# EAGLE design RGB LED 1.2 (EAGLE 5.04)
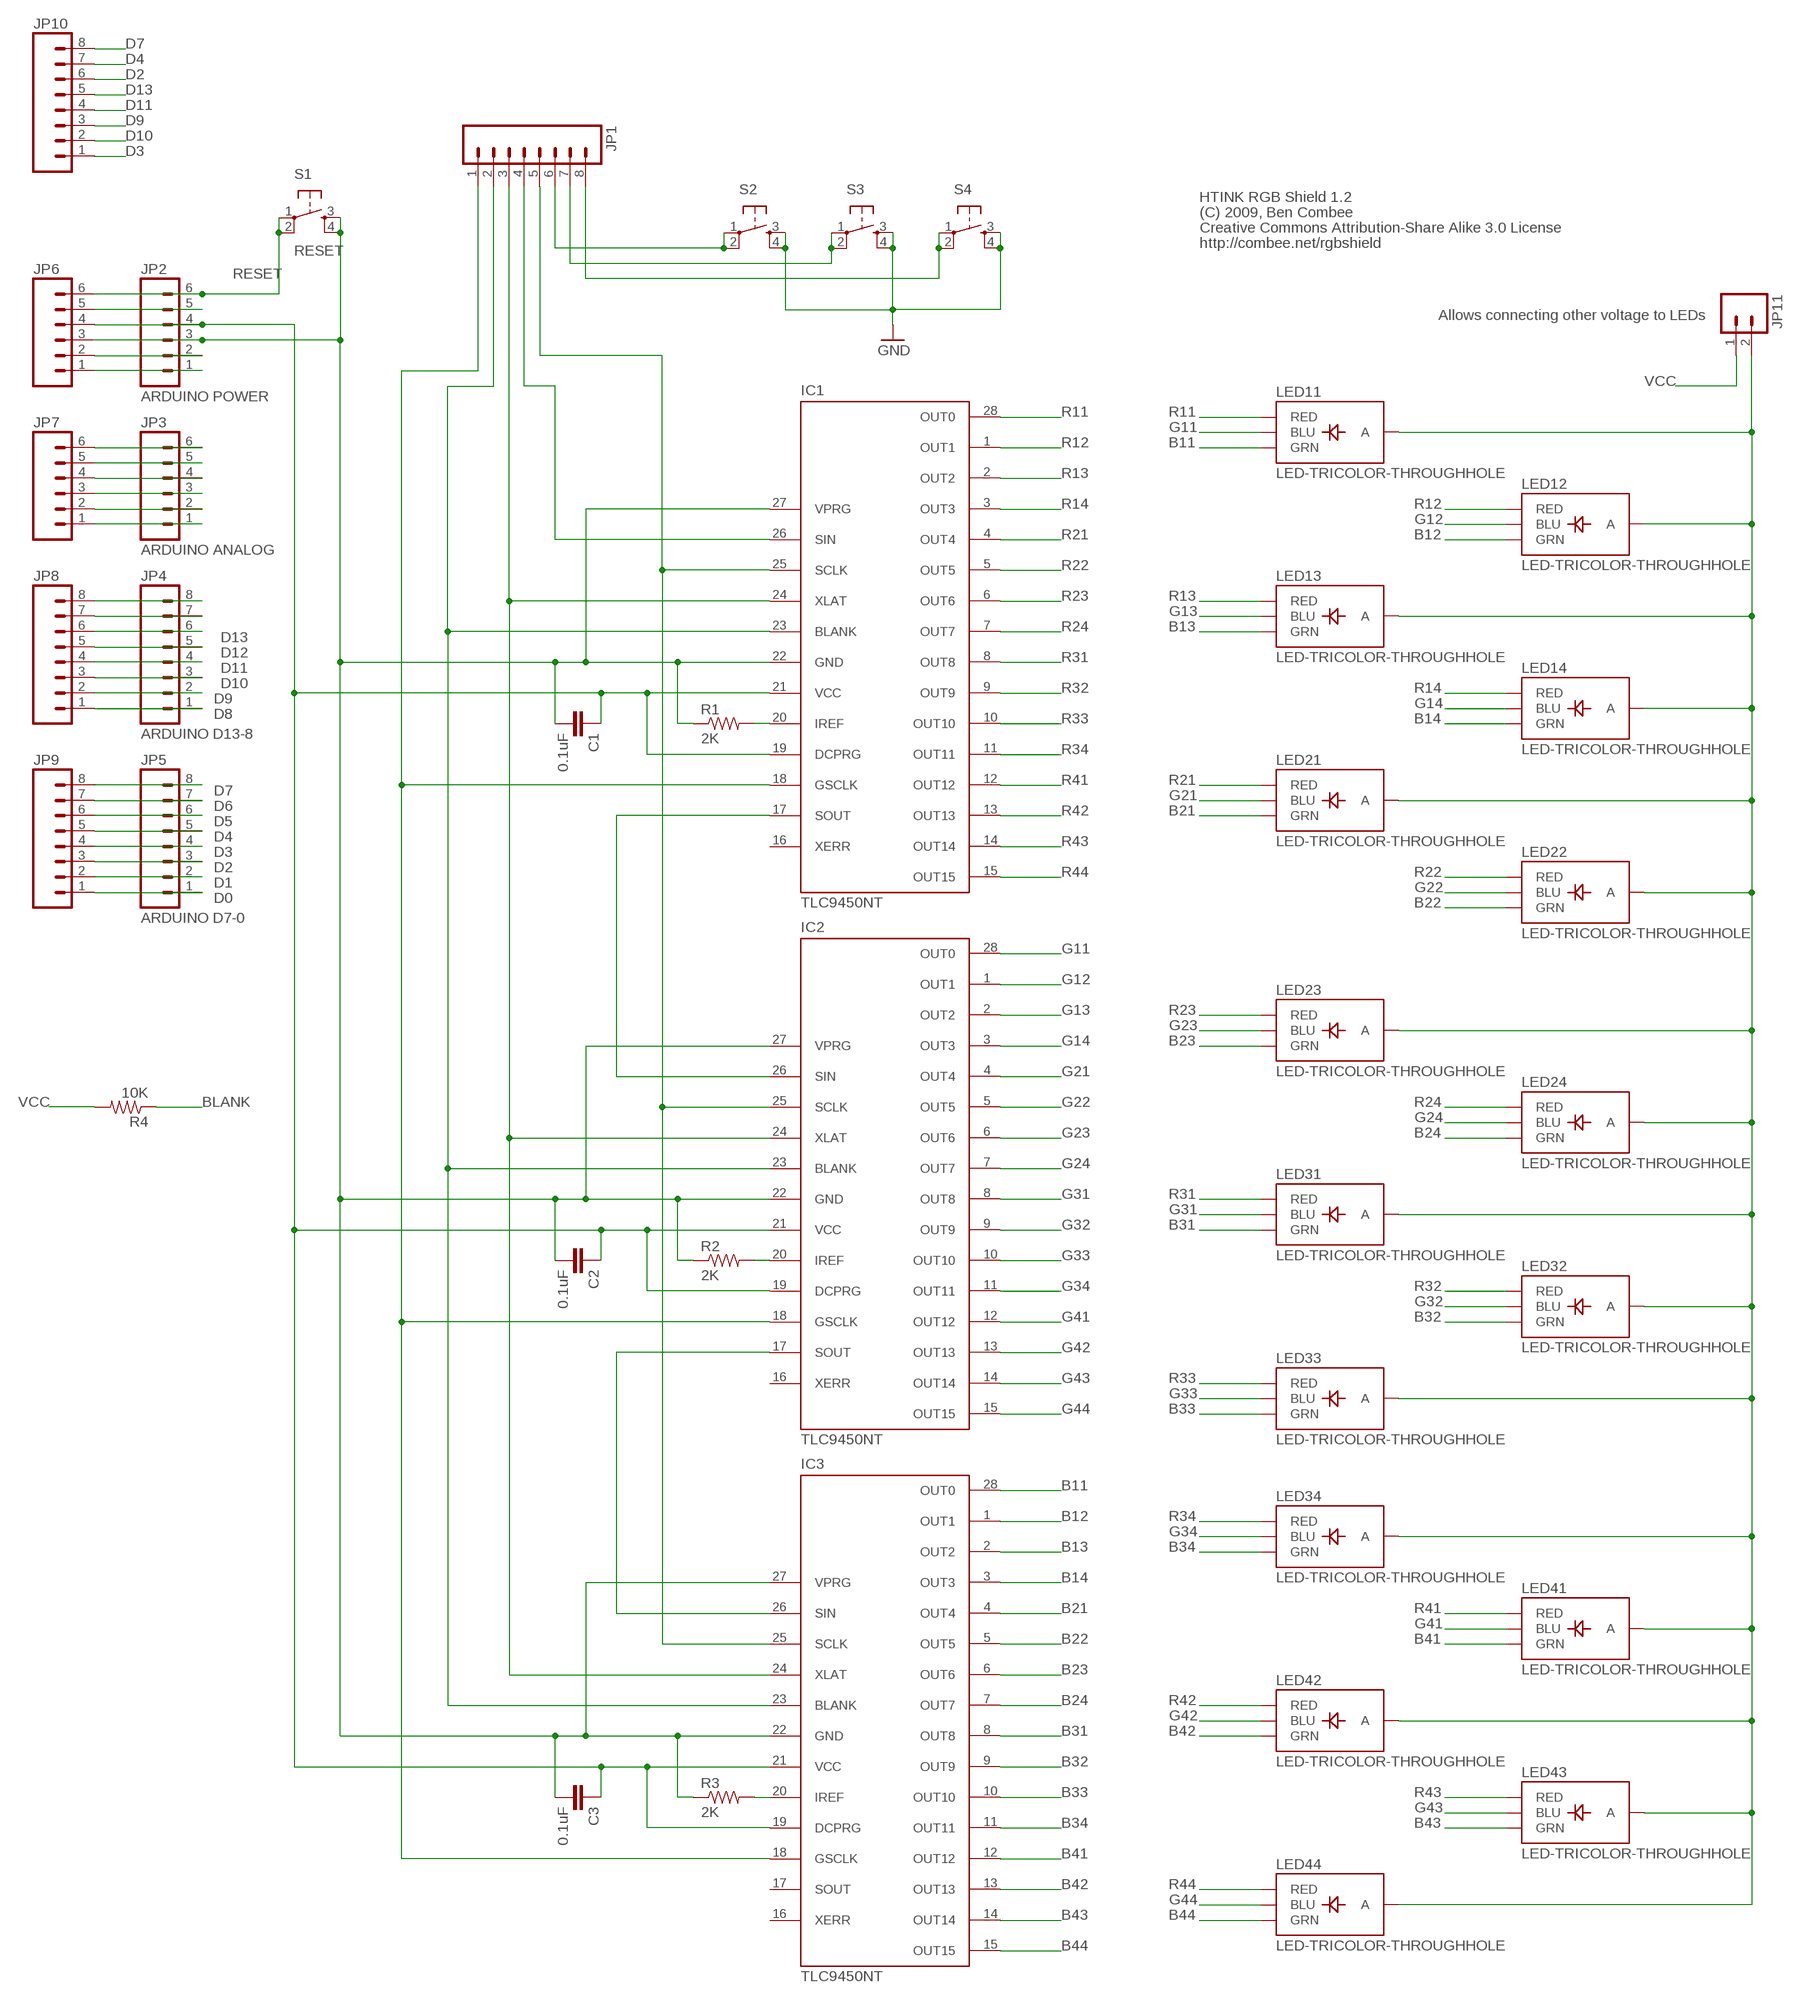
[diagram p0: schematic, sheet 1]

## Parts
C1  0.1uF  CAPPTH  [CAP-PTH-SMALL]
C2  0.1uF  CAPPTH  [CAP-PTH-SMALL]
C3  0.1uF  CAPPTH  [CAP-PTH-SMALL]
IC1  TLC9450NT  [DIL28-3]
IC2  TLC9450NT  [DIL28-3]
IC3  TLC9450NT  [DIL28-3]
JP1  M08LOCK  [1X08_LOCK]
JP2  ARDUINO POWER  M06LOCK  [1X06_LOCK]
JP3  ARDUINO ANALOG  M06LOCK  [1X06_LOCK]
JP4  ARDUINO D13-8  M08LOCK  [1X08_LOCK]
JP5  ARDUINO D7-0  M08LOCK  [1X08_LOCK]
JP6  M06LOCK  [1X06_LOCK]
JP7  M06LOCK  [1X06_LOCK]
JP8  M08LOCK  [1X08_LOCK]
JP9  M08LOCK  [1X08_LOCK]
JP10  M08LOCK  [1X08_LOCK]
JP11  M02LOCK  [1X02_LOCK]
LED11  LED-TRICOLOR-THROUGHHOLE  [LED-TRICOLOR-THROUGHHOLE]
LED12  LED-TRICOLOR-THROUGHHOLE  [LED-TRICOLOR-THROUGHHOLE]
LED13  LED-TRICOLOR-THROUGHHOLE  [LED-TRICOLOR-THROUGHHOLE]
LED14  LED-TRICOLOR-THROUGHHOLE  [LED-TRICOLOR-THROUGHHOLE]
LED21  LED-TRICOLOR-THROUGHHOLE  [LED-TRICOLOR-THROUGHHOLE]
LED22  LED-TRICOLOR-THROUGHHOLE  [LED-TRICOLOR-THROUGHHOLE]
LED23  LED-TRICOLOR-THROUGHHOLE  [LED-TRICOLOR-THROUGHHOLE]
LED24  LED-TRICOLOR-THROUGHHOLE  [LED-TRICOLOR-THROUGHHOLE]
LED31  LED-TRICOLOR-THROUGHHOLE  [LED-TRICOLOR-THROUGHHOLE]
LED32  LED-TRICOLOR-THROUGHHOLE  [LED-TRICOLOR-THROUGHHOLE]
LED33  LED-TRICOLOR-THROUGHHOLE  [LED-TRICOLOR-THROUGHHOLE]
LED34  LED-TRICOLOR-THROUGHHOLE  [LED-TRICOLOR-THROUGHHOLE]
LED41  LED-TRICOLOR-THROUGHHOLE  [LED-TRICOLOR-THROUGHHOLE]
LED42  LED-TRICOLOR-THROUGHHOLE  [LED-TRICOLOR-THROUGHHOLE]
LED43  LED-TRICOLOR-THROUGHHOLE  [LED-TRICOLOR-THROUGHHOLE]
LED44  LED-TRICOLOR-THROUGHHOLE  [LED-TRICOLOR-THROUGHHOLE]
R1  2K  R-US_0309/12  [0309/12]
R2  2K  R-US_0309/12  [0309/12]
R3  2K  R-US_0309/12  [0309/12]
R4  10K  R-US_0309/12  [0309/12]
S1  RESET  TAC_SWITCHPTH  [TACTILE-PTH]
S2  TAC_SWITCHPTH  [TACTILE-PTH]
S3  TAC_SWITCHPTH  [TACTILE-PTH]
S4  TAC_SWITCHPTH  [TACTILE-PTH]

## Nets
B11: IC3.28(OUT0) LED11.GRN
B12: IC3.1(OUT1) LED12.GRN
B13: IC3.2(OUT2) LED13.GRN
B14: IC3.3(OUT3) LED14.GRN
B21: IC3.4(OUT4) LED21.GRN
B22: IC3.5(OUT5) LED22.GRN
B23: IC3.6(OUT6) LED23.GRN
B24: IC3.7(OUT7) LED24.GRN
B31: IC3.8(OUT8) LED31.GRN
B32: IC3.9(OUT9) LED32.GRN
B33: IC3.10(OUT10) LED33.GRN
B34: IC3.11(OUT11) LED34.GRN
B41: IC3.12(OUT12) LED41.GRN
B42: IC3.13(OUT13) LED42.GRN
B43: IC3.14(OUT14) LED43.GRN
B44: IC3.15(OUT15) LED44.GRN
BLANK: IC1.23(BLANK) IC2.23(BLANK) IC3.23(BLANK) JP1.2 R4.1
D0: JP5.1 JP9.1
D1: JP5.2 JP9.2
D2: JP5.3 JP9.3 JP10.6
D3: JP5.4 JP9.4 JP10.1
D4: JP5.5 JP9.5 JP10.7
D5: JP5.6 JP9.6
D6: JP5.7 JP9.7
D7: JP5.8 JP9.8 JP10.8
D8: JP4.1 JP8.1
D9: JP4.2 JP8.2 JP10.3
D10: JP4.3 JP8.3 JP10.2
D11: JP4.4 JP8.4 JP10.4
D12: JP4.5 JP8.5
D13: JP4.6 JP8.6 JP10.5
G11: IC2.28(OUT0) LED11.BLU
G12: IC2.1(OUT1) LED12.BLU
G13: IC2.2(OUT2) LED13.BLU
G14: IC2.3(OUT3) LED14.BLU
G21: IC2.4(OUT4) LED21.BLU
G22: IC2.5(OUT5) LED22.BLU
G23: IC2.6(OUT6) LED23.BLU
G24: IC2.7(OUT7) LED24.BLU
G31: IC2.8(OUT8) LED31.BLU
G32: IC2.9(OUT9) LED32.BLU
G33: IC2.10(OUT10) LED33.BLU
G34: IC2.11(OUT11) LED34.BLU
G41: IC2.12(OUT12) LED41.BLU
G42: IC2.13(OUT13) LED42.BLU
G43: IC2.14(OUT14) LED43.BLU
G44: IC2.15(OUT15) LED44.BLU
GND: C1.2 C2.2 C3.2 IC1.22(GND) IC1.27(VPRG) IC2.22(GND) IC2.27(VPRG) IC3.22(GND) IC3.27(VPRG) JP2.3 JP6.3 R1.1 R2.1 R3.1 S1.3 S1.4 S2.3 S2.4 S3.3 S3.4 S4.3 S4.4
GSCLK: IC1.18(GSCLK) IC2.18(GSCLK) IC3.18(GSCLK) JP1.1
N$1: IC1.17(SOUT) IC2.26(SIN)
N$2: IC2.17(SOUT) IC3.26(SIN)
N$3: JP1.6 S2.1 S2.2
N$4: IC3.20(IREF) R3.2
N$5: IC2.20(IREF) R2.2
N$6: IC1.20(IREF) R1.2
N$7: JP2.5 JP6.5
N$8: JP2.2 JP6.2
N$9: JP2.1 JP6.1
N$10: JP3.6 JP7.6
N$11: JP3.5 JP7.5
N$12: JP3.4 JP7.4
N$13: JP3.3 JP7.3
N$14: JP3.2 JP7.2
N$15: JP3.1 JP7.1
N$16: JP4.8 JP8.8
N$17: JP4.7 JP8.7
N$18: JP11.2 LED11.GND(A) LED12.GND(A) LED13.GND(A) LED14.GND(A) LED21.GND(A) LED22.GND(A) LED23.GND(A) LED24.GND(A) LED31.GND(A) LED32.GND(A) LED33.GND(A) LED34.GND(A) LED41.GND(A) LED42.GND(A) LED43.GND(A) LED44.GND(A)
N$32: JP1.7 S3.1 S3.2
N$33: JP1.8 S4.1 S4.2
R11: IC1.28(OUT0) LED11.RED
R12: IC1.1(OUT1) LED12.RED
R13: IC1.2(OUT2) LED13.RED
R14: IC1.3(OUT3) LED14.RED
R21: IC1.4(OUT4) LED21.RED
R22: IC1.5(OUT5) LED22.RED
R23: IC1.6(OUT6) LED23.RED
R24: IC1.7(OUT7) LED24.RED
R31: IC1.8(OUT8) LED31.RED
R32: IC1.9(OUT9) LED32.RED
R33: IC1.10(OUT10) LED33.RED
R34: IC1.11(OUT11) LED34.RED
R41: IC1.12(OUT12) LED41.RED
R42: IC1.13(OUT13) LED42.RED
R43: IC1.14(OUT14) LED43.RED
R44: IC1.15(OUT15) LED44.RED
RESET: JP2.6 JP6.6 S1.1 S1.2
SCLK: IC1.25(SCLK) IC2.25(SCLK) IC3.25(SCLK) JP1.5
SIN: IC1.26(SIN) JP1.4
VCC: C1.1 C2.1 C3.1 IC1.19(DCPRG) IC1.21(VCC) IC2.19(DCPRG) IC2.21(VCC) IC3.19(DCPRG) IC3.21(VCC) JP2.4 JP6.4 JP11.1 R4.2
XLAT: IC1.24(XLAT) IC2.24(XLAT) IC3.24(XLAT) JP1.3
Unconnected: IC1.16(XERR) IC2.16(XERR) IC3.16(XERR) IC3.17(SOUT)

## Notes on the sheet
- HTINK RGB Shield 1.2
- (C) 2009, Ben Combee
- Creative Commons Attribution-Share Alike 3.0 License
- http://combee.net/rgbshield
- Allows connecting other voltage to LEDs

## Library data of the parts
C1-C3 = SparkFun:CAP: Capacitor Standard 0603 ceramic capacitor, and 0.1" leaded capacitor.
IC1-IC3 = combee:TLC9450NT: TI TLC5940 16 Channel LED Driver
JP1 JP4 JP5 JP8-JP10 = SparkFun:M08: Header 8 Standard 8-pin 0.1" header. Use with straight break away headers (SKU : PRT-00116), right angle break away headers (PRT-00553), swiss pins (PRT-00743), machine pins (PRT-00117), and female headers (PRT-00115).
JP2 JP3 JP6 JP7 = SparkFun:M06: Header 6 Standard 6-pin 0.1" header. Use with straight break away headers (SKU : PRT-00116), right angle break away headers (PRT-00553), swiss pins (PRT-00743), machine pins (PRT-00117), and female headers (PRT-00115). Molex polarized connector foot print use with SKU : PRT-08094 with associated crimp pins and housings. NOTES ON THE VARIANTS LOCK and LOCK_LONGPADS... This footprint was designed to help hold the alignment of a through-hole component (i.e. 6-pin header) while soldering it into place. You may notice that each hole has been shifted either up or down by 0.005 of an inch from it's more standard position (which is a perfectly straight line). This slight alteration caused the pins (the squares in the middle) to touch the edges of the holes. Because they are alternating, it causes a "brace" to hold the component in place. 0.005 has proven to be the perfect amount of "off-center" position when using our standard breakaway headers. Although looks a little odd when you look at the bare footprint, once you have a header in there, the alteration is very hard to notice. Also, if you push a header all the way into place, it is covered up entirely on the bottom side. This idea of altering the position of holes to aid alignment will be further integrated into the Sparkfun Library for other footprints. It can help hold any component with 3 or more connection pins.
JP11 = SparkFun:M02: Header 2 Standard 2-pin 0.1" header. Use with straight break away headers (SKU : PRT-00116), right angle break away headers (PRT-00553), swiss pins (PRT-00743), machine pins (PRT-00117), and female headers (PRT-00115). Molex polarized connector foot print use with SKU : PRT-08233 with associated crimp pins and housings.
LED11-LED14 LED21-LED24 LED31-LED34 LED41-LED44 = SparkFun:LED-TRICOLOR-THROUGHHOLE
R1-R4 = resistor:R-US_: RESISTOR, American symbol
S1-S4 = SparkFun:TAC_SWITCH: Momentary Switch Button commonly used for reset or general input. Spark Fun Electronics SKU : COM-00097

## Board
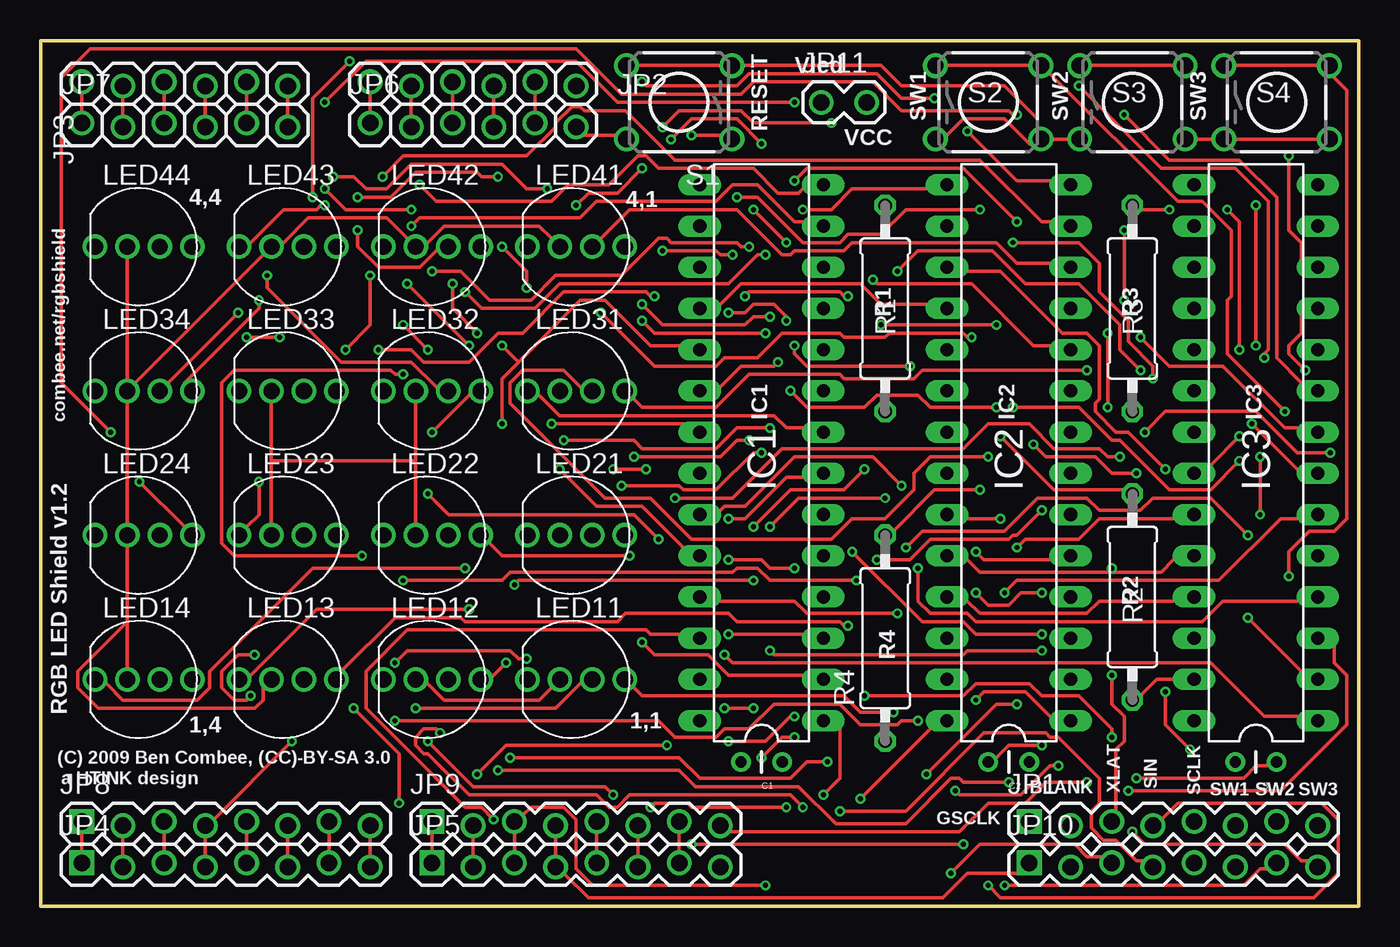
[diagram p1: board, top side]
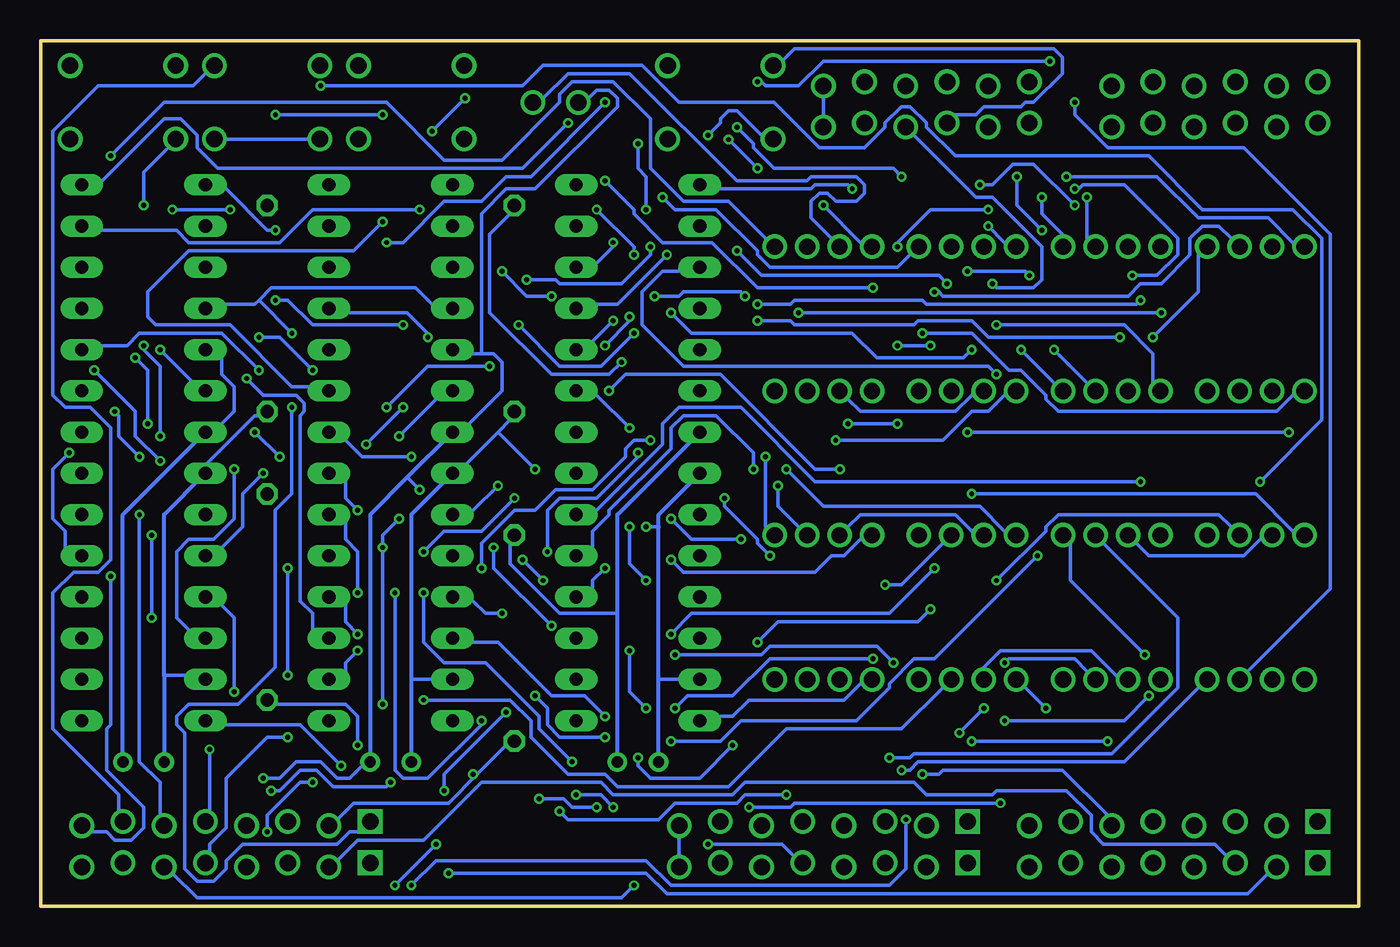
[diagram p2: board, bottom side, seen from below]

Size 81.28 x 53.34 mm. Coordinates in mm from the lower left corner, seen from the top.
Outline: 0,0 81.28,0 81.28,53.34 0,53.34 0,0
Copper layers (1*16): Top 0.035mm / dielectric 1.5mm / Bottom 0.035mm
Design rules "rule_manufacture": minimum track width 8mil, minimum drill 12mil, track to track 8mil, track to pad 8mil, pad to pad 6mil, via to via 10mil, smd to smd 0mil, copper to edge 10mil, drill to drill 10mil, minimum pad ring 10mil, minimum via ring 6mil, stop-mask expansion 2mil, vias tented up to drill 25mil, thermal gap 10mil

### Footprints (pad centres in the part's own frame; a part is rotated, then mirrored left to right if it is on the bottom)
CAP-PTH-SMALL = drill 0.7 round: 1 0,0; 2 2.54,0
DIL28-3 = drill 0.813 long: 1 -16.51,-3.81; 2 -13.97,-3.81; 3 -11.43,-3.81; 4 -8.89,-3.81; 5 -6.35,-3.81; 6 -3.81,-3.81; 7 -1.27,-3.81; 8 1.27,-3.81; 9 3.81,-3.81; 10 6.35,-3.81; 11 8.89,-3.81; 12 11.43,-3.81; 13 13.97,-3.81; 14 16.51,-3.81; 15 16.51,3.81; 16 13.97,3.81; 17 11.43,3.81; 18 8.89,3.81; 19 6.35,3.81; 20 3.81,3.81; 21 1.27,3.81; 22 -1.27,3.81; 23 -3.81,3.81; 24 -6.35,3.81; 25 -8.89,3.81; 26 -11.43,3.81; 27 -13.97,3.81; 28 -16.51,3.81
1X08_LOCK = drill 1.016 square: 1 0,0.127 | drill 1.016 round: 2 2.54,-0.127; 3 5.08,0.127; 4 7.62,-0.127; 5 10.16,0.127; 6 12.7,-0.127; 7 15.24,0.127; 8 17.78,-0.127
1X06_LOCK = drill 1.016 round: 1 0,0; 2 2.54,-0.254; 3 5.08,0; 4 7.62,-0.254; 5 10.16,0; 6 12.7,-0.254
1X02_LOCK = drill 1.016 round: 1 -0.127,0; 2 2.667,0
LED-TRICOLOR-THROUGHHOLE = drill 1 round: BLU 1,0; GND -1,0; GRN 3,0; RED -3,0
0309/12 = drill 0.813 octagon: 1 -6.35,0; 2 6.35,0
TACTILE-PTH = drill 1.016 round: 1 -3.251,2.261; 2 3.251,2.261; 3 -3.251,-2.261; 4 3.251,-2.261

### Placement (x,y rotation side)
C1  45.72,8.89 180 top
C2  60.96,8.89 180 top
C3  76.2,8.89 180 top
IC1  44.45,27.94 90 top
IC2  59.69,27.94 90 top
IC3  74.93,27.94 90 top
JP1  60.96,5.08 0 top
JP2  20.32,50.8 0 top
JP3  2.54,50.8 0 top
JP4  2.54,2.54 0 top
JP5  24.13,2.54 0 top
JP6  20.32,48.26 0 top
JP7  2.54,48.26 0 top
JP8  2.54,5.08 0 top
JP9  24.13,5.08 0 top
JP10  60.96,2.54 0 top
JP11  48.26,49.53 0 top
LED11  33.02,13.97 0 top
LED12  24.13,13.97 0 top
LED13  15.24,13.97 0 top
LED14  6.35,13.97 0 top
LED21  33.02,22.86 0 top
LED22  24.13,22.86 0 top
LED23  15.24,22.86 0 top
LED24  6.35,22.86 0 top
LED31  33.02,31.75 0 top
LED32  24.13,31.75 0 top
LED33  15.24,31.75 0 top
LED34  6.35,31.75 0 top
LED41  33.02,40.64 0 top
LED42  24.13,40.64 0 top
LED43  15.24,40.64 0 top
LED44  6.35,40.64 0 top
R1  52.07,36.83 90 top
R2  67.31,19.05 90 top
R3  67.31,36.83 90 top
R4  52.07,16.51 90 top
S1  39.37,49.53 180 top
S2  58.42,49.53 0 top
S3  67.31,49.53 0 top
S4  76.2,49.53 0 top

### Tracks (layer width: path | path; a pad name or v marks a point on that pad's centre or on a via)
B11  (via drill 0.3)
  Top 0.203: v62.74,8.64 62.23,8.64 60.45,6.86 56.64,6.86 v56.39,7.11 | v52.58,11.94 50.55,11.94 49.53,12.95 37.08,12.95 36.58,13.46 LED11.GRN
  Bottom 0.203: v62.74,8.64 65.28,11.18 69.85,11.18 IC3.28 | v56.39,7.11 56.39,8.13 v52.58,11.94
B12  (via drill 0.3)
  Top 0.203: v42.16,15.49 42.67,14.99 72.14,14.99 75.44,11.68 77.47,11.68 IC3.1 | v28.7,14.99 27.69,13.97 LED12.GRN
  Bottom 0.203: v42.16,15.49 36.83,15.49 36.32,16 29.72,16 v28.7,14.99
B13  (via drill 0.3)
  Top 0.203: v74.42,17.78 77.72,14.48 IC3.2 | v74.42,22.86 72.14,25.15 68.58,25.15 67.82,24.38 65.28,24.38 64.52,25.15 61.47,25.15 59.44,23.11 54.36,23.11 v53.34,22.1 | v49.78,17.27 49.53,17.27 49.28,17.53 42.93,17.53 42.42,18.03 36.07,18.03 35.56,17.53 26.16,17.53 25.91,17.78 21.84,17.78 18.54,14.48 LED13.GRN
  Bottom 0.203: v74.42,22.86 v74.42,17.78 | v53.34,22.1 53.34,20.83 v49.78,17.27
B14  (via drill 0.3)
  Top 0.203: v67.06,7.11 76.45,7.11 80.52,11.18 80.52,14.22 79.76,14.99 79.76,16 IC3.3 | v59.69,7.62 56.9,7.62 56.64,7.87 56.13,7.87 53.34,5.08 49.02,5.08 46.74,7.37 40.39,7.37 39.37,8.38 v28.19,8.38
  Bottom 0.203: v67.06,7.11 66.55,7.11 65.28,8.38 64.26,8.38 63.25,7.37 59.94,7.37 v59.69,7.62 | v28.19,8.38 27.69,8.38 27.18,8.89 14.48,8.89 9.91,13.46 LED14.GRN
B21  (via drill 0.3)
  Top 0.203: v54.1,20.83 54.1,18.8 54.86,18.03 57.15,18.03 57.66,17.53 71.63,17.53 72.9,18.8 77.47,18.8 IC3.4 | v43.69,28.7 42.93,28.7 41.91,27.69 v36.58,27.69
  Bottom 0.203: v54.1,20.83 54.1,22.35 52.07,24.38 50.8,24.38 49.53,25.65 47.24,25.65 45.21,27.69 45.21,28.19 44.7,28.7 v43.69,28.7 | v36.58,27.69 36.58,23.37 LED21.GRN
B22  (via drill 0.3)
  Top 0.203: v79.5,27.94 77.47,27.94 74.93,30.48 69.34,30.48 v68.07,29.21 | v66.55,27.69 65.79,27.69 65.28,28.19 62.48,28.19 60.96,29.72 58.42,29.72 56.9,28.19 45.72,28.19 42.67,25.15 v39.12,25.15 | v36.32,21.59 28.45,21.59 27.69,22.35 LED22.GRN
  Bottom 0.203: v79.5,27.94 80.52,26.92 80.52,23.88 79.76,23.11 79.76,22.1 IC3.5 | v66.55,27.69 v68.07,29.21 | v39.12,25.15 39.12,24.64 37.08,22.61 37.08,22.35 v36.32,21.59
B23  (via drill 0.3)
  Top 0.203: v59.44,19.3 60.2,20.07 72.64,20.07 76.45,23.88 77.47,23.88 IC3.6 | v54.1,11.43 53.09,11.43 52.83,11.18 50.55,11.18 49.28,12.45 45.21,12.45 43.69,10.92 42.16,10.92 41.66,10.41 39.12,10.41 38.1,11.43 v21.84,11.43 | v12.95,12.95 12.7,12.7 11.94,12.7 11.18,13.46 11.18,14.48 12.19,15.49 v13.21,15.49
  Bottom 0.203: v59.44,19.3 59.44,8.38 58.93,7.87 57.4,7.87 54.1,11.18 v54.1,11.43 | v21.84,11.43 14.48,11.43 v12.95,12.95 | v13.21,15.49 17.78,20.07 17.78,22.35 LED23.GRN
B24  (via drill 0.3)
  Top 0.203: v74.68,29.72 77.47,26.92 IC3.7 | v75.44,33.78 75.44,34.04 75.69,34.29 75.69,43.43 73.66,45.47 69.09,45.47 v64.01,50.55 | v6.1,26.16 8.89,23.37 LED24.GRN
  Bottom 0.203: v74.68,29.72 74.68,33.02 v75.44,33.78 | v64.01,50.55 51.56,50.55 50.29,51.82 44.2,51.82 41.91,49.53 36.07,49.53 33.27,46.74 30.48,46.74 29.21,48.01 29.21,48.26 28.19,49.28 27.69,49.28 26.67,48.26 26.67,48.01 24.89,46.23 12.95,46.23 9.65,42.93 4.06,42.93 2.29,41.15 2.29,29.97 v6.1,26.16
B31  (via drill 0.3)
  Top 0.203: v67.82,35.05 69.6,33.27 72.9,33.27 76.71,29.46 77.47,29.46 IC3.8 | v64.52,33.02 54.36,33.02 53.85,32.51 49.53,32.51 49.28,32.77 43.69,32.77 41.66,30.73 37.08,30.73 36.58,31.24 LED31.GRN
  Bottom 0.203: v67.82,35.05 66.55,35.05 v64.52,33.02
B32  (via drill 0.3)
  Top 0.203: v66.8,48.77 69.6,45.97 73.91,45.97 76.2,43.69 76.2,33.78 77.72,32.26 IC3.9 | v60.2,48.77 59.94,48.77 59.69,49.02 53.09,49.02 51.31,50.8 43.94,50.8 43.18,50.04 35.81,50.04 33.02,52.83 3.05,52.83 1.27,51.05 1.27,32.26 v4.32,29.21 | v24.13,29.21 26.42,31.5 LED32.GRN
  Bottom 0.203: v60.2,48.77 v66.8,48.77 | v4.32,29.21 v24.13,29.21
B33  (via drill 0.3)
  Top 0.203: v67.82,33.02 66.55,34.29 66.55,35.81 64.01,38.35 60.71,38.35 58.67,40.39 54.1,40.39 v52.83,39.12 | v49.78,37.59 49.53,37.59 49.28,37.85 43.69,37.85 v43.43,37.59 | v37.85,37.59 37.59,37.59 37.34,37.85 32.26,37.85 29.72,35.31 28.19,35.31 26.42,33.53 23.62,33.53 22.86,34.29 v20.83,34.29
  Bottom 0.203: v67.82,33.02 70.1,35.31 75.18,35.31 75.95,34.54 77.47,34.54 IC3.10 | v52.83,39.12 51.31,37.59 v49.78,37.59 | v43.43,37.59 41.91,37.59 41.66,37.85 38.1,37.85 v37.85,37.59 | v20.83,34.29 18.8,32.26 LED33.GRN
B34  (via drill 0.3)
  Top 0.203: v77.98,33.02 76.96,34.04 76.96,34.54 77.72,35.31 77.72,36.32 IC3.11 | v73.91,27.43 72.14,25.65 69.6,25.65 66.55,28.7 66.04,28.7 64.01,30.73 v59.94,30.73 | v53.59,33.27 47.24,33.27 46.48,34.04 v46.48,34.54 | v44.96,36.32 43.94,36.32 43.43,35.81 38.35,35.81 v37.08,37.08 | v13.46,37.34 13.46,36.83 8.89,32.26 LED34.GRN
  Bottom 0.203: v77.98,33.02 75.44,30.48 75.44,28.96 v73.91,27.43 | v59.94,30.73 57.4,33.27 v53.59,33.27 | v46.48,34.54 44.96,36.07 v44.96,36.32 | v37.08,37.08 35.05,37.08 34.8,37.34 26.92,37.34 26.67,37.08 13.72,37.08 v13.46,37.34
B41  (via drill 0.3)
  Top 0.203: v76.96,46.23 76.96,41.66 77.72,40.89 77.72,39.88 IC3.12
  Bottom 0.203: v76.96,46.23 73.66,49.53 59.94,49.53 56.39,45.97 52.83,45.97 49.28,49.53 49.28,50.04 48.51,50.8 45.97,50.8 43.69,48.51 43.69,45.47 41.66,43.43 38.86,43.43 36.58,41.15 LED41.GRN
B42  (via drill 0.3)
  Top 0.203: v57.91,42.93 53.34,42.93 51.82,41.4 49.78,41.4 49.28,40.89 46.99,40.89 44.2,43.69 v42.93,43.69
  Bottom 0.203: v57.91,42.93 64.52,42.93 66.55,40.89 72.14,40.89 72.9,41.66 77.47,41.66 IC3.13 | v42.93,43.69 42.16,42.93 39.62,42.93 37.08,40.39 37.08,40.13 36.32,39.37 28.45,39.37 27.69,40.13 LED42.GRN
B43  (via drill 0.3)
  Top 0.203: v48.77,48.26 43.94,48.26 43.18,49.02 39.37,49.02 v38.35,48.01 | v28.19,44.96 27.18,44.96 26.92,45.21 23.11,45.21 21.59,43.69 v19.56,43.69
  Bottom 0.203: v48.77,48.26 51.56,45.47 70.36,45.47 71.63,46.74 71.63,47.5 72.64,48.51 73.66,48.51 77.47,44.7 IC3.14 | v38.35,48.01 37.34,46.99 37.34,46.74 36.07,45.47 28.7,45.47 v28.19,44.96 | v19.56,43.69 19.56,42.67 18.03,41.15 LED43.GRN
B44  (via drill 0.3)
  Top 0.203: v66.8,37.34 v66.8,41.66 | v51.82,35.81 v58.93,35.81 | v44.7,35.31 37.85,35.31 v37.08,36.07 | v12.7,35.05 v14.73,35.05
  Bottom 0.203: v66.8,41.66 67.31,41.66 69.85,44.2 IC3.15 | v66.8,37.34 66.04,37.34 64.52,35.81 v58.93,35.81 | v51.82,35.81 49.28,33.27 46.74,33.27 v44.7,35.31 | v37.08,36.07 35.05,36.07 34.8,35.81 27.43,35.81 27.18,36.07 23.88,36.07 22.86,35.05 v14.73,35.05 | v12.7,35.05 9.91,37.85 9.91,40.13 LED44.GRN
BLANK  (via drill 0.3)
  Top 0.203: v53.09,25.91 51.31,27.69 46.48,27.69 43.43,24.64 42.16,24.64 41.91,24.38 IC1.23 | v60.2,22.1 60.71,22.61 64.01,22.61 65.28,23.88 69.85,23.88 IC3.23 | v59.18,23.88 57.15,23.88 IC2.23 | v54.61,8.13 58.93,12.45 v60.2,12.45
  Bottom 0.203: 54.36,8.13 56.13,6.35 61.98,6.35 62.99,5.33 JP1.2 | 54.36,8.13 52.58,9.91 R4.1 | v53.09,25.91 54.61,24.38 IC2.23 | v59.18,23.88 60.2,22.86 v60.2,22.1 v60.2,12.45 | 54.36,8.13 v54.61,8.13
D0
  Top 0.203: JP5.1 JP9.1
D1
  Top 0.203: JP5.2 JP9.2
D2  (via drill 0.3)
  Top 0.203: JP5.3 JP9.3 29.72,5.59 30.23,6.1 32.26,6.1 33.02,5.33 33.02,2.29 34.04,1.27 v44.7,1.27
  Bottom 0.203: v44.7,1.27 45.47,0.51 71.63,0.51 73.15,2.03 JP10.6
D3
  Top 0.203: JP9.4 JP5.4 32.26,2.03 33.78,0.51 55.63,0.51 57.15,2.03 60.45,2.03 JP10.1
D4  (via drill 0.3)
  Top 0.203: JP5.5 JP9.5 | v59.44,1.27 74.17,1.27 75.18,2.29 75.69,2.29 JP10.7 | v40.13,3.81 v56.9,3.81
  Bottom 0.203: v56.9,3.81 v59.44,1.27 | v40.13,3.81 35.56,3.81 34.8,3.05 JP5.5
D5
  Top 0.203: JP5.6 JP9.6
D6
  Top 0.203: JP5.7 JP9.7
D7  (via drill 0.3)
  Top 0.203: v67.31,4.57 68.07,3.81 76.71,3.81 77.72,2.79 78.23,2.79 JP10.8 | v64.52,7.62 61.98,7.62 60.71,6.35 58.42,6.35 56.64,4.57 42.42,4.57 JP9.8
  Bottom 0.203: JP5.8 JP9.8 | v67.31,4.57 67.31,5.59 65.28,7.62 v64.52,7.62
D8
  Top 0.203: JP4.1 JP8.1
D9  (via drill 0.3)
  Top 0.203: JP4.2 JP8.2 | v56.13,2.03 57.91,3.81 63.75,3.81 64.52,3.05 65.53,3.05 JP10.3
  Bottom 0.203: v56.13,2.03 43.94,2.03 42.67,0.76 6.86,0.76 5.59,2.03 JP4.2
D10
  Top 0.203: JP4.3 JP8.3
  Bottom 0.203: JP10.2 62.99,2.79 61.72,4.06 57.66,4.06 54.1,7.62 46.74,7.62 45.97,6.86 38.61,6.86 37.85,7.62 27.43,7.62 26.67,6.86 22.61,6.86 22.35,7.11 18.03,7.11 16.51,5.59 16.51,4.57 15.75,3.81 8.89,3.81 8.13,3.05 JP4.3
D11  (via drill 0.3)
  Top 0.203: JP4.4 JP8.4 10.67,5.33 v15.49,10.16 | v49.28,5.84 53.34,5.84 58.17,10.67 61.98,10.67 62.23,10.41 62.74,10.41 65.28,7.87 65.28,6.35 64.77,5.84 64.77,4.83 65.53,4.06 66.29,4.06 67.56,2.79 68.07,2.79 JP10.4 | v35.31,6.86 34.8,7.37 26.67,7.37 v23.88,10.16
  Bottom 0.203: v49.28,5.84 48.77,5.33 43.18,5.33 42.16,6.35 38.35,6.35 37.85,6.86 v35.31,6.86 | v15.49,10.16 v23.88,10.16
D12
  Top 0.203: JP4.5 JP8.5
D13  (via drill 0.3)
  Top 0.203: JP4.6 JP8.6 | v66.04,10.41 66.04,10.92 64.01,12.95 61.72,12.95 60.96,13.72 57.66,13.72 56.9,12.95 v50.8,12.95 | v46.48,10.41 45.72,10.41 v44.45,9.14 | v38.61,9.91 28.7,9.91 v26.92,8.13
  Bottom 0.203: v66.04,10.41 67.31,10.41 69.85,7.87 69.85,4.83 70.87,3.81 70.87,3.3 JP10.5 | v50.8,12.95 50.04,12.19 50.04,11.18 49.28,10.41 v46.48,10.41 | v44.45,9.14 44.45,8.64 43.69,7.87 40.64,7.87 v38.61,9.91 | v26.92,8.13 25.91,8.13 25.65,8.38 18.29,8.38 15.49,5.59 JP8.6
G11  (via drill 0.3)
  Top 0.203: v50.55,6.6 54.86,10.92 IC2.28 | v46.99,6.1 46.23,6.86 36.32,6.86 35.56,6.1 35.05,6.1 34.29,6.86 26.42,6.86 23.88,9.4 23.62,9.4 23.11,9.91 23.11,10.41 23.62,10.92 24.38,10.92 v24.64,10.67 | v23.11,12.19 31.75,12.19 33.27,13.72 LED11.BLU
  Bottom 0.203: v50.55,6.6 49.02,6.6 48.51,6.1 v46.99,6.1 | v24.64,10.67 v23.11,12.19
G12  (via drill 0.3)
  Top 0.203: v57.66,12.7 58.17,13.21 60.71,13.21 62.23,11.68 IC2.1
  Bottom 0.203: v57.66,12.7 52.32,12.7 51.05,11.43 51.05,10.41 48.77,8.13 46.48,8.13 45.72,7.37 38.86,7.37 35.31,10.92 28.19,10.92 25.65,13.46 LED12.BLU
G13  (via drill 0.3)
  Top 0.203: v61.72,15.75 57.15,15.75 56.9,15.49 45.21,15.49 v44.96,15.75 | v42.16,12.19 v43.94,12.19 | v29.97,15.24 29.46,15.24 28.96,15.75 22.61,15.75 v21.84,14.99
  Bottom 0.203: v61.72,15.75 62.48,14.99 62.48,14.48 IC2.2 | v44.96,15.75 44.96,13.21 v43.94,12.19 | v42.16,12.19 41.4,12.95 38.61,12.95 36.32,15.24 v29.97,15.24 | v21.84,14.99 21.59,15.24 17.53,15.24 16.76,14.48 LED13.BLU
G14  (via drill 0.3)
  Top 0.203: v68.58,32.51 68.58,33.27 67.06,34.8 67.06,36.07 65.28,37.85 65.28,39.62 64.01,40.89 v59.94,40.89 | v46.48,49.53 35.56,49.53 33.02,52.07 20.07,52.07 v17.53,49.53
  Bottom 0.203: v68.58,32.51 67.56,31.5 65.53,31.5 65.02,30.99 65.02,30.48 65.28,30.23 65.28,18.8 64.52,18.03 64.52,17.02 IC2.3 | v59.94,40.89 58.93,40.89 56.39,43.43 54.1,43.43 52.58,44.96 51.05,44.96 v46.48,49.53 | v17.53,49.53 17.53,48.77 15.49,46.74 7.11,46.74 1.78,41.4 1.78,19.56 6.86,14.48 LED14.BLU
G21  (via drill 0.3)
  Top 0.203: v61.72,16.76 57.66,16.76 56.9,17.53 54.36,17.53 v50.04,21.84 | v44.45,27.94 43.94,27.94 41.66,25.65 39.62,25.65 39.37,25.91 v35.81,25.91
  Bottom 0.203: v61.72,16.76 62.48,17.53 62.48,18.54 IC2.4 | v50.04,21.84 50.04,24.38 49.28,25.15 46.99,25.15 44.45,27.69 v44.45,27.94 | v35.81,25.91 35.81,24.64 34.54,23.37 LED21.BLU
G22  (via drill 0.3)
  Top 0.203: v57.66,21.84 58.17,21.34 62.23,21.34 IC2.5 | v52.07,25.15 46.74,25.15 v44.96,23.37 | v43.94,20.07 29.46,20.07 v29.21,19.81
  Bottom 0.203: v57.66,21.84 56.39,23.11 54.1,23.11 v52.07,25.15 | v44.96,23.37 44.96,21.08 v43.94,20.07 | v29.21,19.81 28.19,19.81 25.65,22.35 LED22.BLU
G23  (via drill 0.3)
  Top 0.203: v61.72,19.3 60.45,19.3 59.69,18.54 58.42,18.54 v57.66,19.3 | v48.51,8.89 47.24,8.89 46.23,7.87 40.64,7.87 39.37,9.14 v28.96,9.14
  Bottom 0.203: v61.72,19.3 61.72,21.84 62.48,22.61 62.48,23.62 IC2.6 | v57.66,19.3 57.66,16.26 56.39,14.99 53.85,14.99 50.55,11.68 50.55,10.92 v48.51,8.89 | v28.96,9.14 27.69,9.14 27.43,9.4 15.24,9.4 11.18,13.46 11.18,17.78 15.75,22.35 LED23.BLU
G24  (via drill 0.3)
  Top 0.203: v61.72,24.38 60.2,22.86 59.94,22.86 59.69,22.61 54.86,22.61 53.59,21.34 v51.56,21.34 | v50.29,20.07 44.96,20.07 44.2,20.83 42.93,20.83 42.67,20.57 28.96,20.57 28.45,20.07 v22.35,20.07
  Bottom 0.203: v61.72,24.38 62.48,25.15 62.48,26.16 IC2.7 | v50.29,20.07 v51.56,21.34 | v22.35,20.07 19.3,23.11 19.3,23.37 18.54,24.13 8.64,24.13 7.87,23.37 LED24.BLU
G31  (via drill 0.3)
  Top 0.203: v58.42,27.69 54.86,27.69 53.85,26.67 53.85,25.65 52.07,23.88 50.04,23.88 48.77,22.61 40.13,22.61 37.59,25.15 34.8,25.15 28.96,30.99 28.96,32.26 29.72,33.02 32.26,33.02 33.27,32 LED31.BLU
  Bottom 0.203: v58.42,27.69 61.47,27.69 62.48,28.7 IC2.8
G32  (via drill 0.3)
  Top 0.203: v60.2,42.16 56.9,45.47 47.24,45.47 v46.48,44.7 | v29.97,38.1 29.97,39.12 v28.45,40.64 | v22.86,42.93 18.8,42.93 v17.53,44.2 | v13.97,38.86 13.97,38.1 18.54,33.53 22.86,33.53 24.38,32 LED32.BLU
  Bottom 0.203: v60.2,42.16 61.98,40.39 72.14,40.39 74.68,37.85 74.68,36.32 74.17,35.81 69.6,35.81 65.79,32 64.77,32 IC2.9 | v46.48,44.7 44.7,42.93 44.7,42.67 42.93,40.89 39.88,40.89 37.08,38.1 v29.97,38.1 | v28.45,40.64 28.45,40.89 26.42,42.93 v22.86,42.93 | v17.53,44.2 17.27,44.2 17.02,44.45 14.48,44.45 11.18,41.15 11.18,40.13 12.45,38.86 v13.97,38.86
G33  (via drill 0.3)
  Top 0.203: v51.31,38.61 51.56,38.35 57.4,38.35 61.21,34.54 62.23,34.54 IC2.10 | v43.69,40.64 43.18,40.64 42.93,40.89 38.86,40.89 38.61,41.15 38.1,41.15 35.81,38.86 31.75,38.86 30.23,37.34 27.69,37.34 25.91,39.12 v24.13,39.12 | v20.32,38.86 20.32,35.81 v18.8,34.29
  Bottom 0.203: v51.31,38.61 49.53,38.61 49.28,38.35 45.47,38.35 43.69,40.13 v43.69,40.64 | v24.13,39.12 20.57,39.12 v20.32,38.86 | v18.8,34.29 16.76,32.26 LED33.BLU
G34  (via drill 0.3)
  Top 0.203: v57.4,35.05 57.15,35.05 56.9,35.31 52.32,35.31 52.07,35.05 49.53,35.05 49.28,35.31 45.72,35.31 44.2,33.78 42.16,33.78 41.66,33.27 37.85,33.27 v34.54,36.58 | v12.19,36.58 7.87,32.26 LED34.BLU
  Bottom 0.203: v57.4,35.05 57.4,35.31 58.67,36.58 62.23,36.58 IC2.11 | v12.19,36.58 v34.54,36.58
G41
  Top 0.203: IC2.12 62.23,39.62 60.2,39.62 58.93,40.89 50.04,40.89 49.53,40.39 46.48,40.39 46.23,40.13 45.72,40.13 42.93,42.93 36.32,42.93 34.54,41.15 LED41.BLU
G42  (via drill 0.3)
  Top 0.203: v21.08,44.96 22.35,46.23 29.97,46.23 31.75,48.01 31.75,48.26 32.77,49.28 33.27,49.28 33.53,49.02 36.07,49.02 39.12,45.97 57.91,45.97 61.72,42.16 62.23,42.16 IC2.13 | v19.56,41.66 19.56,40.64 20.83,39.37 23.37,39.37 24.38,40.39 LED42.BLU
  Bottom 0.203: v21.08,44.96 21.08,43.18 v19.56,41.66
G43  (via drill 0.3)
  Top 0.203: v57.15,47.75 60.2,44.7 62.23,44.7 IC2.14 | v55.12,49.78 53.09,49.78 51.56,51.31 43.69,51.31 42.93,50.55 37.34,50.55 v37.08,50.8 | v19.05,52.07 16.76,49.78 v16.76,43.69
  Bottom 0.203: v55.12,49.78 v57.15,47.75 | v37.08,50.8 36.83,50.8 36.58,50.55 34.54,50.55 33.02,52.07 v19.05,52.07 | v16.76,43.69 16.76,41.15 LED43.BLU
G44  (via drill 0.3)
  Top 0.203: v46.99,42.93 48.77,42.93 50.04,44.2 54.61,44.2 IC2.15 | v44.7,40.13 44.2,40.13 42.42,38.35 32,38.35 30.48,36.83 27.18,36.83 v26.16,37.85
  Bottom 0.203: v46.99,42.93 44.7,40.64 v44.7,40.13 | v26.16,37.85 25.91,37.85 25.65,37.59 14.22,37.59 13.46,38.35 12.19,38.35 10.41,40.13 10.41,41.15 9.65,41.91 8.64,41.91 7.87,41.15 LED44.BLU
GND  (via drill 0.3)
  Top 0.203: R2.1 67.82,12.95 68.83,13.97 IC3.27 | v43.94,23.37 46.23,25.65 49.53,25.65 v50.8,26.92 | v61.72,9.91 59.69,9.91 58.93,9.14 C2.2 | S2.3 55.88,47.5 56.9,48.51 59.44,48.51 60.96,46.99 S2.4 | S3.3 63.5,47.24 62.23,47.24 S2.4 | S3.4 71.12,47.24 72.39,47.24 S4.3 73.66,47.24 78.74,47.24 S4.4 | JP6.3 JP2.3 | S1.4 36.83,51.82 41.91,51.82 S1.3 43.18,51.82 51.82,51.82 53.09,50.55 59.44,50.55 61.47,48.51 61.47,48.01 S2.4 | v73.91,28.96 72.14,27.18 IC3.22 | v74.93,34.54 v74.93,43.18
  Bottom 0.203: R3.1 67.82,30.23 68.07,30.23 71.12,27.18 IC3.22 | 73.66,14.22 72.39,14.22 IC3.27 | 43.18,13.97 IC1.27 | 58.42,13.97 IC2.27 | 53.09,29.21 55.12,27.18 IC2.22 | 53.09,29.21 52.32,29.97 R1.1 | 43.18,23.37 v43.94,23.37 | v50.8,26.92 53.09,29.21 | v61.72,9.91 61.72,11.68 62.48,12.45 66.8,12.45 R2.1 | S3.3 64.77,47.24 69.85,47.24 S3.4 | JP6.3 24.89,48.77 23.62,48.77 23.11,49.28 20.83,49.28 20.57,49.53 20.07,49.53 18.29,51.31 18.29,52.32 18.8,52.83 34.8,52.83 35.56,52.07 S1.4 | v73.91,28.96 73.91,33.27 74.93,34.29 v74.93,34.54 | v74.93,43.18 74.93,45.21 73.41,46.74 S4.3
  Bottom 0.254: C1.2 43.18,13.97 43.18,23.37 43.18,24.13 IC1.22 | C2.2 58.42,13.97 58.42,24.13 IC2.22 | C3.2 73.66,14.22 73.66,24.13 IC3.22
GSCLK  (via drill 0.3)
  Top 0.203: IC1.18 41.91,37.08 43.18,38.35 50.55,38.35 51.82,37.08 54.61,37.08 IC2.18 | v65.79,30.73 v65.79,35.31
  Bottom 0.203: 67.82,37.34 67.06,38.1 58.17,38.1 57.15,37.08 IC2.18 | 67.82,37.34 68.07,37.08 69.85,37.08 IC3.18 | v65.79,30.73 65.79,25.4 66.8,24.38 66.8,14.73 69.09,12.45 72.14,12.45 72.9,11.68 72.9,11.18 72.39,10.67 72.39,2.29 71.63,1.52 70.61,1.52 69.85,2.29 69.85,2.79 68.83,3.81 62.99,3.81 62.23,4.57 61.47,4.57 JP1.1 | v65.79,35.31 67.82,37.34
N$1  (via drill 0.3)
  Top 0.203: v22.35,32.77 21.84,32.77 21.59,33.02 11.94,33.02 11.18,32.26 11.18,22.35 11.94,21.59 v19.81,21.59 | v42.42,10.16 44.7,10.16 46.23,11.68 v46.48,11.68
  Bottom 0.203: v22.35,32.77 22.86,33.27 41.66,33.27 44.2,35.81 44.2,37.85 42.93,39.12 41.91,39.12 IC1.17 | v19.81,21.59 26.16,15.24 27.43,15.24 28.96,13.72 28.96,13.46 30.99,11.43 38.1,11.43 39.37,10.16 v42.42,10.16 | v46.48,11.68 47.75,12.95 49.78,12.95 53.09,16.26 54.61,16.26 IC2.26
N$2  (via drill 0.3)
  Top 0.203: v69.34,26.92 67.06,29.21 66.29,29.21 65.02,30.48 65.02,30.99 65.28,31.24 65.28,34.54 64.52,35.31 62.99,35.31 59.18,39.12 57.15,39.12 IC2.17
  Bottom 0.203: v69.34,26.92 69.34,23.88 70.61,22.61 72.14,22.61 72.9,21.84 72.9,17.78 72.14,17.02 IC3.26
N$3  (via drill 0.3)
  Top 0.203: S2.1 55.88,51.82 60.96,51.82 S2.2 62.23,51.31 70.1,43.43 71.63,43.43 73.41,41.66 73.41,37.59 73.15,37.34 73.15,34.04 v76.71,30.48 | v75.18,24.13 v75.18,27.69
  Bottom 0.203: v75.18,24.13 75.18,8.89 73.91,7.62 73.91,5.59 JP1.6 | v75.18,27.69 76.45,28.96 76.45,30.23 v76.71,30.48
N$4  (via drill 0.3)
  Top 0.203: v69.6,42.93 67.82,42.93 R3.2 | v73.15,42.93 73.91,42.16 v73.91,34.29
  Bottom 0.203: v73.15,42.93 v69.6,42.93 | v73.91,34.29 71.88,32.26 IC3.20
N$5  (via drill 0.3)
  Top 0.203: v59.18,28.96 62.48,25.65 66.8,25.65 R2.2
  Bottom 0.203: v59.18,28.96 56.9,31.24 IC2.20
N$6  (via drill 0.3)
  Top 0.203: v45.47,33.53 45.21,33.27 43.18,33.27 41.91,32 IC1.20
  Bottom 0.203: v45.47,33.53 46.23,32.77 49.78,32.77 53.59,36.58 53.59,41.4 52.32,42.67 R1.2
N$7
  Top 0.203: JP6.5 JP2.5
N$8
  Top 0.203: JP6.2 JP2.2
N$9
  Top 0.203: JP6.1 JP2.1
N$10
  Top 0.203: JP7.6 JP3.6
N$11
  Top 0.203: JP7.5 JP3.5
N$12
  Top 0.203: JP7.4 JP3.4
N$13
  Top 0.203: JP7.3 JP3.3
N$14
  Top 0.203: JP7.2 JP3.2
N$15
  Top 0.203: JP7.1 JP3.1
N$16
  Top 0.203: JP4.8 JP8.8
N$17
  Top 0.203: JP4.7 JP8.7
N$18
  Top 0.203: LED41.GND 31.5,41.15 30.73,41.91 24.89,41.91 23.88,40.89 LED42.GND 22.61,41.15 21.34,42.42 16.51,42.42 14.99,40.89 LED43.GND 13.72,40.13 5.84,32.26 LED34.GND | 14.22,27.43 14.22,31.24 LED33.GND | 14.22,27.43 14.22,23.37 LED23.GND | 23.11,27.43 23.11,31.24 LED32.GND | 23.11,27.43 23.11,23.37 LED22.GND | 14.22,27.43 23.11,27.43 | LED11.GND 31.5,13.46 30.73,12.7 24.89,12.7 23.88,13.72 LED12.GND | 5.33,17.53 5.33,22.35 LED24.GND 5.33,23.37 5.33,31.24 LED34.GND | 5.33,17.53 5.33,14.48 LED14.GND | LED34.GND 5.33,32.26 5.33,40.13 LED44.GND | 5.33,17.53 2.29,14.48 2.29,13.46 3.56,12.19 13.21,12.19 13.72,12.7 13.72,13.46 LED13.GND
  Bottom 0.203: JP11.2 50.29,49.78 48.77,51.31 44.96,51.31 38.35,44.7 34.04,44.7 33.78,44.96 30.99,44.96 30.48,44.45 30.48,43.94 30.99,43.43 32.26,43.43 32.77,43.94 33.27,43.94 33.78,43.43 33.78,42.42 32.51,41.15 LED41.GND | LED21.GND 31.5,23.37 30.73,24.13 24.89,24.13 23.88,23.11 LED22.GND | LED31.GND 31.5,31.24 30.73,30.48 24.89,30.48 23.88,31.5 LED32.GND | LED13.GND 14.99,14.22 16.51,15.75 22.1,15.75 23.37,14.48 LED12.GND | LED23.GND 13.72,22.35 12.95,21.59 7.11,21.59 6.1,22.61 LED24.GND
N$32
  Top 0.203: S3.1 64.77,51.82 69.85,51.82 S3.2
  Bottom 0.203: JP1.7 76.45,5.84 76.45,6.86 80.52,10.92 80.52,19.3 79.25,20.57 77.72,20.57 76.96,21.34 76.96,29.46 78.23,30.73 79.76,30.73 80.52,31.5 80.52,47.75 77.72,50.55 71.88,50.55 71.12,51.31 S3.2
N$33  (via drill 0.3)
  Top 0.203: S4.1 73.66,51.82 78.74,51.82 S4.2 79.76,51.05 80.52,50.29 80.52,23.88 79.76,23.11 78.23,23.11 76.96,21.84 v76.96,20.32
  Bottom 0.203: v76.96,20.32 76.96,11.18 77.22,10.92 77.22,8.38 74.93,6.1 74.93,4.83 75.69,4.06 76.71,4.06 77.22,4.57 78.23,4.57 JP1.8
R11
  Bottom 0.203: IC1.28 39.37,11.68 38.61,11.68 37.59,12.7 31.75,12.7 30.73,13.72 LED11.RED
R12  (via drill 0.3)
  Top 0.203: v48.26,6.86 49.28,7.87 49.28,10.92 IC1.1 | v45.97,6.1 40.13,6.1 39.88,6.35 37.85,6.35 v37.59,6.1 | v22.1,6.35 22.1,9.4 v19.3,12.19
  Bottom 0.203: v48.26,6.86 46.74,6.86 v45.97,6.1 | v37.59,6.1 35.05,6.1 34.8,6.35 v22.1,6.35 | v19.3,12.19 20.57,13.46 LED12.RED
R13  (via drill 0.3)
  Top 0.203: v37.08,16.26 37.85,15.49 41.15,15.49 42.42,14.22 46.99,14.22 IC1.2 | v26.42,18.29 17.02,18.29 12.95,14.22 LED13.RED
  Bottom 0.203: v37.08,16.26 35.81,17.53 27.18,17.53 v26.42,18.29
R14  (via drill 0.3)
  Top 0.203: v42.42,16.76 46.99,16.76 IC1.3 | v26.16,20.83 16.76,20.83 10.41,14.48 10.41,13.46 9.65,12.7 5.08,12.7 4.06,13.72 LED14.RED
  Bottom 0.203: v42.42,16.76 41.15,18.03 28.96,18.03 v26.16,20.83
R21  (via drill 0.3)
  Top 0.203: v46.48,20.83 44.96,20.83 44.45,21.34 v42.42,21.34
  Bottom 0.203: v46.48,20.83 47.24,20.07 47.24,19.56 IC1.4 | v42.42,21.34 41.66,20.57 33.53,20.57 32.51,21.59 31.75,21.59 30.73,22.61 LED21.RED
R22  (via drill 0.3)
  Top 0.203: v35.31,26.92 v37.34,26.92
  Bottom 0.203: v37.34,26.92 37.34,27.94 39.62,30.23 41.66,30.23 42.42,29.46 42.42,28.19 46.23,24.38 46.23,24.13 47.24,23.11 47.24,22.1 IC1.5 | v35.31,26.92 33.02,24.64 23.37,24.64 21.84,23.11 LED22.RED
R23  (via drill 0.3)
  Top 0.203: v13.46,26.16 13.46,24.13 12.7,23.37 LED23.RED
  Bottom 0.203: v13.46,26.16 33.53,26.16 38.1,30.73 41.91,30.73 42.93,29.72 42.93,28.45 46.99,24.38 IC1.6
R24  (via drill 0.3)
  Top 0.203: v42.42,23.88 43.43,23.88 45.97,26.42 46.99,26.42 IC1.7 | v38.1,22.61 36.58,24.13 25.15,24.13 v23.88,25.4
  Bottom 0.203: v42.42,23.88 41.15,22.61 v38.1,22.61 | v23.88,25.4 6.35,25.4 4.06,23.11 LED24.RED
R31
  Top 0.203: IC1.8 46.99,29.46 45.97,29.46 45.21,30.23 32,30.23 30.73,31.5 LED31.RED
R32  (via drill 0.3)
  Top 0.203: v44.96,29.46 42.93,29.46 41.66,28.19 37.08,28.19 36.58,28.7 v32.26,28.7
  Bottom 0.203: v44.96,29.46 46.99,31.5 IC1.9 | v32.26,28.7 25.65,28.7 23.88,30.48 22.86,30.48 21.84,31.5 LED32.RED
R33  (via drill 0.3)
  Top 0.203: v45.97,36.07 45.97,36.32 45.21,37.08 43.94,37.08 43.43,36.58 v42.42,36.58 | v22.35,35.81 v23.88,34.29
  Bottom 0.203: v45.97,36.07 47.24,34.8 IC1.10 | v42.42,36.58 41.15,35.31 31.24,35.31 29.72,33.78 24.38,33.78 v23.88,34.29 | v22.35,35.81 14.48,35.81 12.7,34.04 12.7,32.26 LED33.RED
R34  (via drill 0.3)
  Top 0.203: v42.67,40.13 41.91,40.13 41.66,40.39 v38.35,40.39 | v25.4,38.35 25.4,36.83 v26.92,35.31
  Bottom 0.203: v42.67,40.13 45.72,37.08 46.99,37.08 IC1.11 | v38.35,40.39 36.83,38.86 25.91,38.86 v25.4,38.35 | v26.92,35.31 23.88,35.31 21.59,33.02 20.83,33.02 19.3,31.5 19.3,31.24 18.54,30.48 5.08,30.48 4.06,31.5 LED34.RED
R41  (via drill 0.3)
  Top 0.203: v43.94,42.93 v45.97,40.89 | v44.45,46.99 42.93,48.51 40.13,48.51 v38.86,47.24 | v37.08,45.47 35.56,43.94 33.78,43.94 v33.02,43.18
  Bottom 0.203: v45.97,40.89 45.97,40.64 46.99,39.62 IC1.12 | v43.94,42.93 43.94,44.96 44.45,45.47 v44.45,46.99 | v37.08,45.47 v38.86,47.24 | v33.02,43.18 30.73,40.89 LED41.RED
R42  (via drill 0.3)
  Top 0.203: v22.86,41.91 23.37,42.42 33.27,42.42 34.29,43.43 41.66,43.43 42.67,44.45 44.2,44.45 46.48,42.16 46.99,42.16 IC1.13
  Bottom 0.203: v22.86,41.91 21.84,40.89 LED42.RED
R43  (via drill 0.3)
  Top 0.203: v23.37,44.45 24.38,43.43 31.5,43.43 32.51,44.45 35.05,44.45 36.83,46.23 37.34,46.23 38.1,45.47 43.94,45.47 45.47,43.94 46.74,43.94 46.99,44.2 IC1.14 | v17.53,43.18 17.27,43.18 17.02,42.93 14.99,42.93 12.95,40.89 LED43.RED
  Bottom 0.203: v23.37,44.45 22.61,44.45 21.34,45.72 20.07,45.72 v17.53,43.18
R44  (via drill 0.3)
  Top 0.203: v31.24,44.2 29.97,44.2 28.45,45.72 22.86,45.72 21.34,44.2 20.07,44.2 19.3,44.96 v18.03,44.96
  Bottom 0.203: v31.24,44.2 31.5,44.45 33.53,44.45 33.78,44.2 39.37,44.2 IC1.15 | v18.03,44.96 12.45,44.96 9.91,42.42 5.59,42.42 4.06,40.89 LED44.RED
RESET  (via drill 0.3)
  Top 0.203: S1.2 35.56,47.5 33.53,47.5 JP6.6 | v40.13,47.5 41.91,47.5 S1.1
  Bottom 0.203: v40.13,47.5 39.37,48.26 39.37,48.51 38.86,49.02 38.35,49.02 36.83,47.5 S1.2 | JP6.6 JP2.6
SCLK  (via drill 0.3)
  Top 0.203: v52.83,18.03 47.24,18.03 46.48,18.8 41.91,18.8 IC1.25 | IC3.25 69.85,18.8 65.28,18.8 64.52,18.03 57.91,18.03 57.15,18.8 IC2.25 | v70.87,9.65 69.34,11.18 v69.34,13.21
  Bottom 0.203: v52.83,18.03 53.85,18.03 54.61,18.8 IC2.25 | v70.87,9.65 70.87,5.84 JP1.5 | v69.34,13.21 69.34,17.78 70.1,18.54 IC3.25
SIN  (via drill 0.3)
  Top 0.203: v27.94,5.33 27.18,6.1 26.16,6.1 20.07,12.19 20.07,14.48 22.61,17.02 37.34,17.02 37.59,16.76 39.37,16.76 IC1.26 | v58.42,1.27 59.18,0.51 78.49,0.51 80.01,2.03 80.01,5.33 78.99,6.35 70.1,6.35 69.09,5.33 JP1.4
  Bottom 0.203: v27.94,5.33 27.94,2.29 28.96,1.27 42.42,1.27 43.94,2.79 56.9,2.79 v58.42,1.27
VCC  (via drill 0.3)
  Top 0.203: JP6.4 JP2.4 | 29.46,33.53 28.45,32.51 v28.45,29.72 | 29.46,33.53 33.27,37.34 34.8,37.34 37.59,34.54 39.37,34.54 IC1.19 | v31.5,29.72 39.62,29.72 IC1.21 | v26.42,34.54 v22.61,38.35 | 29.46,33.53 v28.45,34.54 | v67.56,7.87 74.17,7.87 74.93,8.64 75.69,8.64 C3.1 | v57.91,25.65 55.12,25.65 52.58,23.11 R4.2
  Bottom 0.203: 45.72,18.03 49.28,18.03 52.32,21.08 52.32,22.35 R4.2 | v31.5,29.72 v28.45,29.72 | v22.61,38.35 22.35,38.1 20.07,38.1 19.56,38.61 19.56,40.64 22.61,43.69 23.62,43.69 JP6.4 | v28.45,34.54 v26.42,34.54 | IC3.19 70.1,33.78 70.1,32.77 69.34,32 69.34,30.48 70.1,29.72 IC3.21 | 54.1,34.04 53.34,34.04 52.83,33.53 52.83,31.75 54.86,29.72 IC2.21 | 54.1,34.04 54.61,34.04 IC2.19 | 54.1,34.04 54.1,42.67 52.58,44.2 50.8,44.2 45.72,49.28 45.72,49.78 46.23,50.29 46.99,50.29 47.5,49.78 JP11.1 | v67.56,7.87 66.55,7.87 65.53,8.89 64.01,8.89 62.99,7.87 62.23,7.87 61.47,8.64 C2.1 | v57.91,25.65 58.67,26.42
  Bottom 0.254: C1.1 45.72,18.03 45.72,24.13 IC1.21 | C2.1 60.96,24.13 58.67,26.42 IC2.21 | C3.1 76.2,24.13 IC3.21
XLAT  (via drill 0.3)
  Top 0.203: v32,26.92 34.29,24.64 37.08,24.64 39.62,22.1 IC1.24 | v46.23,31.75 47.24,30.73 50.8,30.73 51.56,31.5 54.1,31.5 54.86,30.73 v58.93,30.73 | v61.21,28.45 61.98,27.69 65.02,27.69 66.04,26.67 v67.56,26.67 | 66.04,20.57 69.09,20.57 69.85,21.34 IC3.24 | 66.04,20.57 57.91,20.57 57.15,21.34 IC2.24 | v66.04,14.22 66.04,12.45 66.8,11.68 66.8,10.16 66.29,9.65 66.29,5.84 JP1.3 | 66.04,20.57 v66.04,20.83
  Bottom 0.203: v32,26.92 33.53,26.92 39.37,32.77 45.21,32.77 v46.23,31.75 | v58.93,30.73 v61.21,28.45 | v67.56,26.67 68.83,25.4 68.83,23.37 70.1,22.1 IC3.24 | v66.04,20.83 v66.04,14.22

### Text on the board
tPlace: Vled | RESET | SW1 | SW2 | SW3 | VCC | 4,4 | 4,1 | R1 | R3 | combee.net/rgbshield | IC1 | IC2 | IC3 | R2 | R4 | RGB LED Shield v1.2 | 1,4 | 1,1 | (C) 2009 Ben Combee, (CC)-BY-SA 3.0 | BLANK | SW1 | SW2 | SW3 | a HTINK design | XLAT | SIN | SCLK | GSCLK